# EasyEDA Pro project Control.epro

# Schematic schematic1
Create Date: 2023-08-01; Page Name: P1; Project Name: 无刷电机驱动控制板; Schematic Name: schematic1; Update Date: 2023-08-13; Company: 嘉立创EDA; Page Size: A4; Version: V1.0
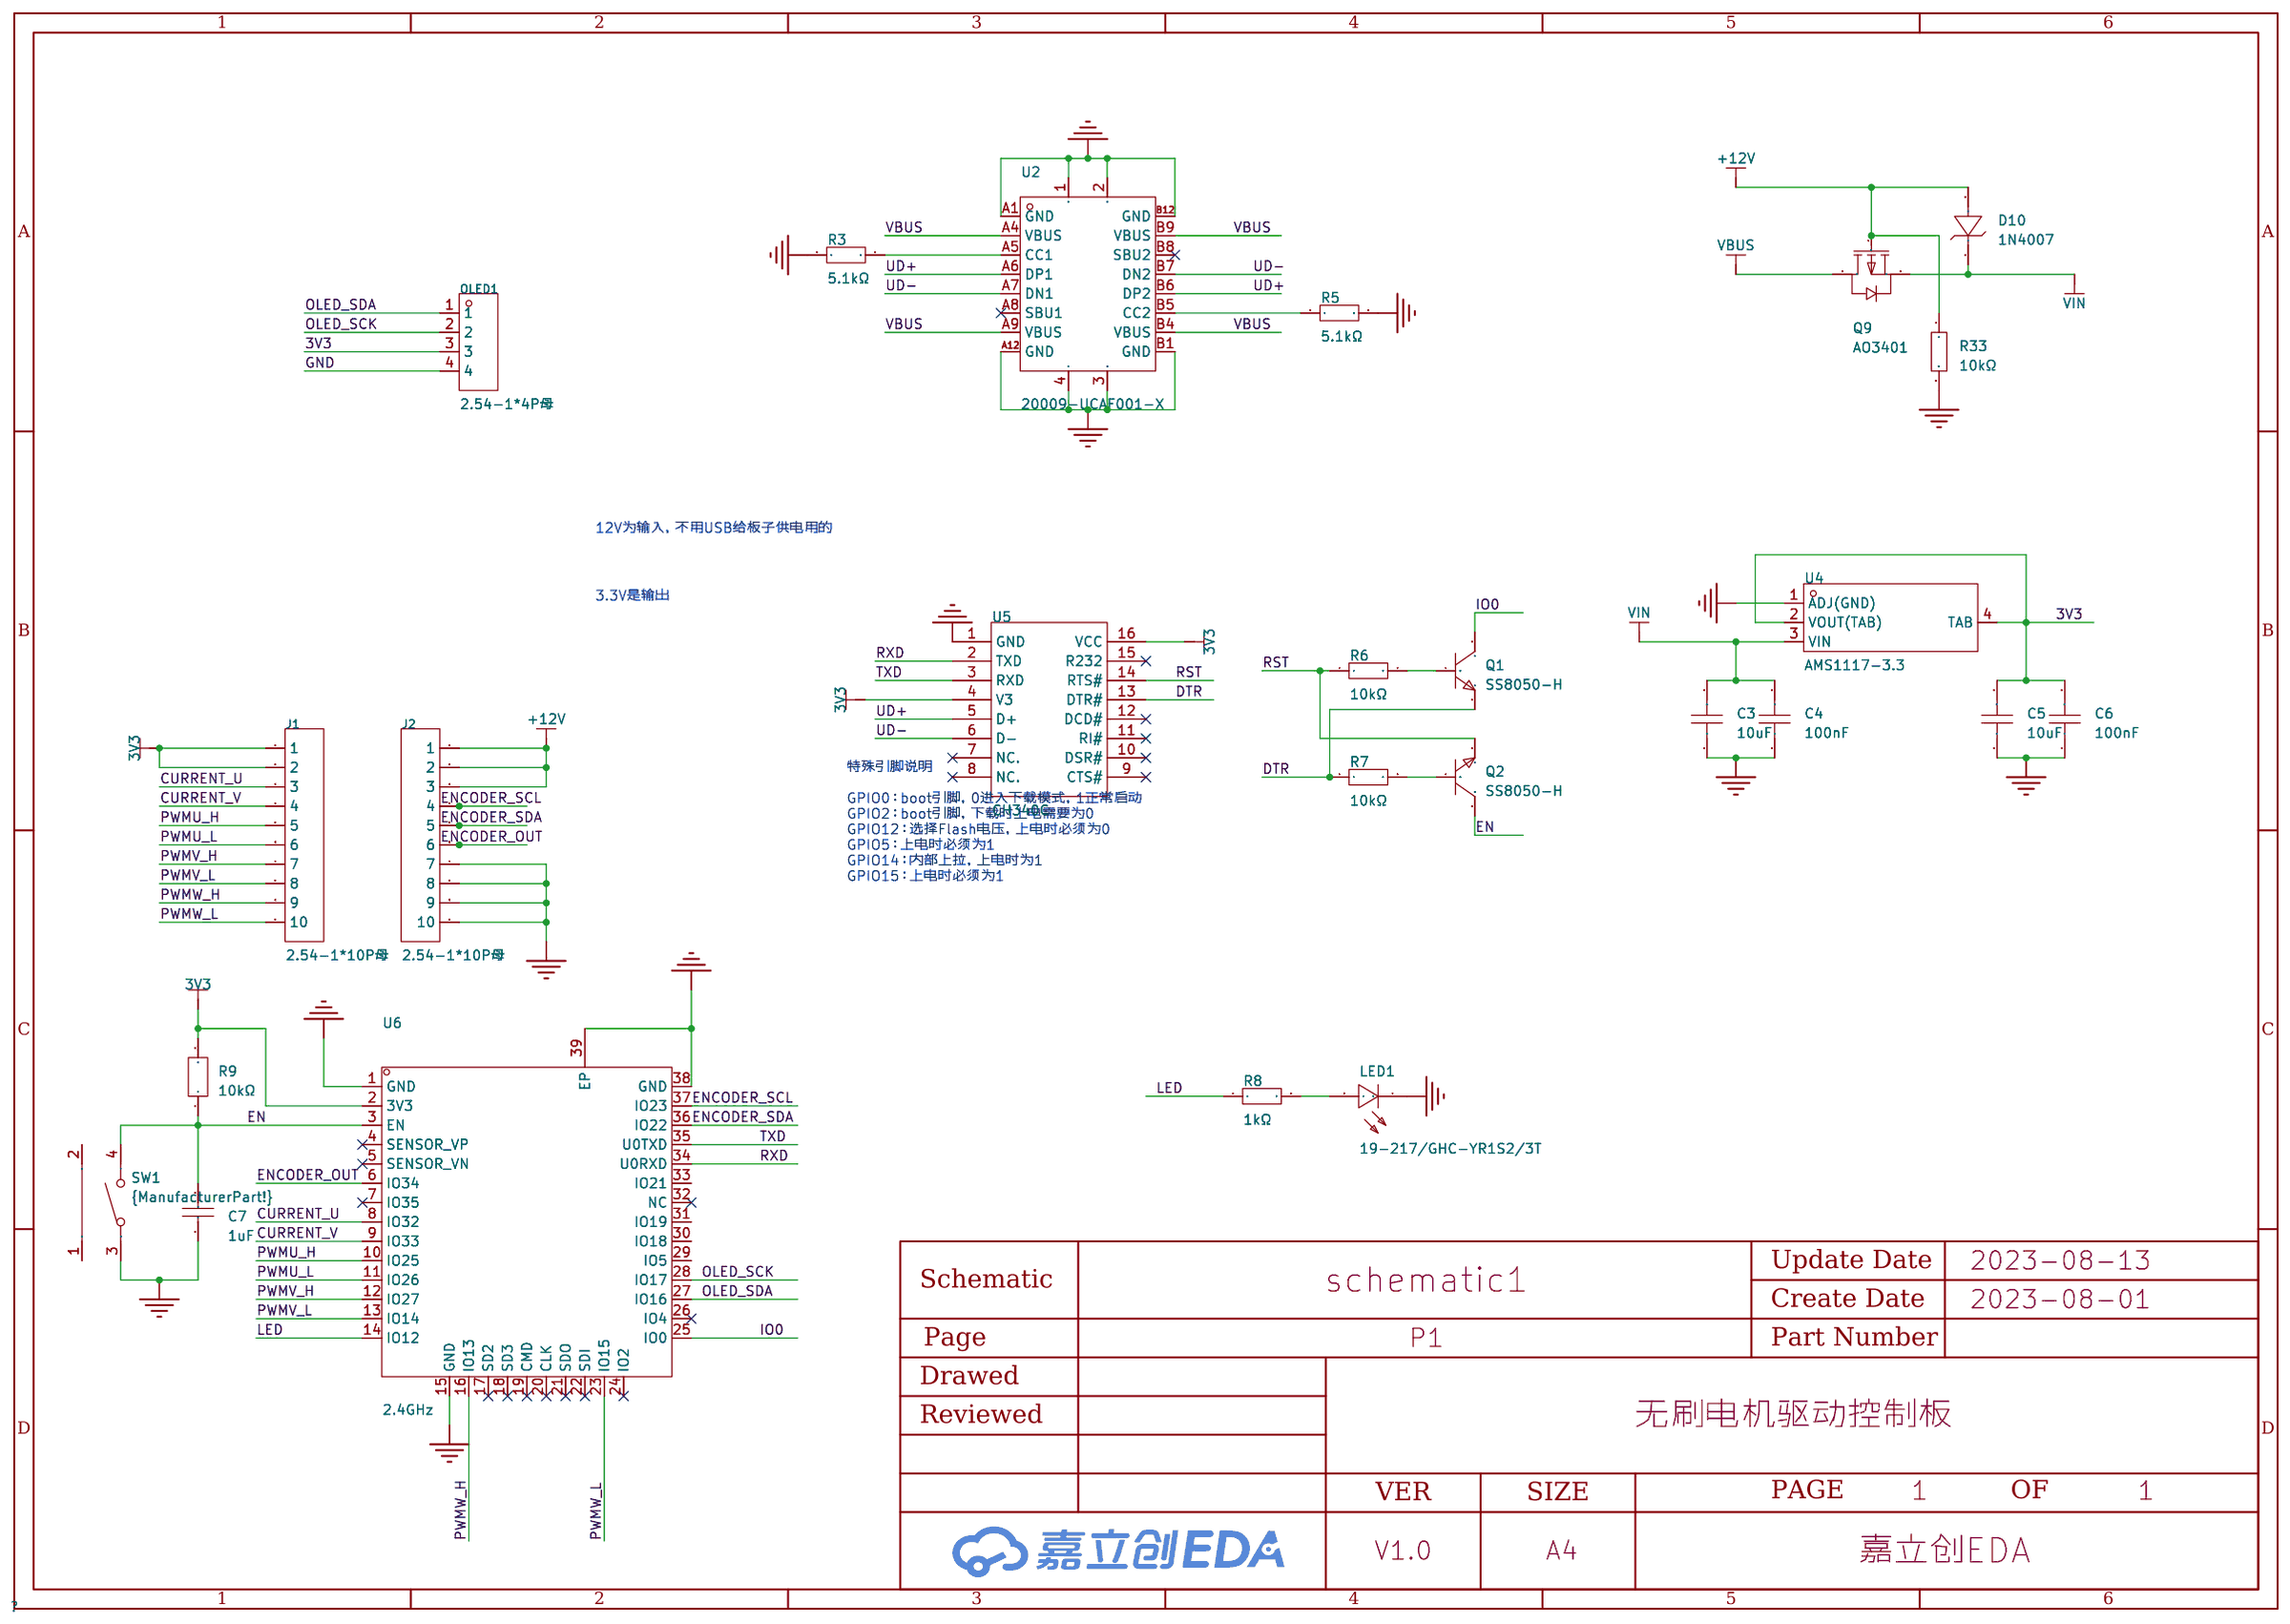
[diagram p0: schematic sheet]

## Parts
C3  10uF  [C0603]
C4  100nF  [C0603]
C5  10uF  [C0603]
C6  100nF  [C0603]
C7  1uF  [C0603]
D10  1N4007  [SOD-123FL_L2.7-W1.8-LS3.8-RD]
J1  2.54-1*10P母  [HDR-TH_10P-P2.54-V-F]
J2  2.54-1*10P母  [HDR-TH_10P-P2.54-V-F]
LED1  19-217/GHC-YR1S2/3T  [LED0603-RD]
OLED1  2.54-1*4P母  [HDR-TH_4P-P2.54-V-F]
Q1  SS8050-H  [SOT-23-3_L2.9-W1.3-P1.90-LS2.4-BR]
Q2  SS8050-H  [SOT-23-3_L2.9-W1.3-P1.90-LS2.4-BR]
Q9  AO3401  [SOT-23-3_L2.9-W1.4-P1.90-LS2.6-BR]
R3  5.1kΩ  [R0603]
R5  5.1kΩ  [R0603]
R6  10kΩ  [R0603]
R7  10kΩ  [R0603]
R8  1kΩ  [R0603]
R9  10kΩ  [R0603]
R33  10kΩ  [R0603]
SW1  -  [SW-SMD_TS24CA]
U2  20009-UCAF001-X  [TYPE-C-SMD_20009-UCAF001-X]
U4  AMS1117-3.3  [SOT-223-4_L6.5-W3.5-P2.30-LS7.0-BR]
U5  CH340C  [SOP-16_L10.0-W3.9-P1.27-LS6.0-BL]
U6  2.4GHz  [WIRELM-SMD_ESP32-S]

## Library data of the parts
C3 C5 = CL10A106MA8NRNC: 容值:10uF;精度:±20%;额定电压:25V;材质(温度系数):X5R;; LCSC Part Name: 10uF±20%25V; Supplier Part: C96446; Manufacturer: SAMSUNG(三星); Supplier Footprint: 0603; JLCPCB Part Class: BasicPart; Datasheet: https://atta.szlcsc.com/upload/public/pdf/source/20170325/1490427913016.pdf; Supplier: LCSC; Tolerance: ±20%; Voltage Rated: 25V; Temperature Coefficient: X5R
C4 C6 = CC0603KRX7R9BB104: 容值:100nF;精度:±10%;额定电压:50V;材质(温度系数):X7R;; LCSC Part Name: 100nF±10%50V; Supplier Part: C14663; Manufacturer: YAGEO(国巨); Supplier Footprint: 0603; JLCPCB Part Class: BasicPart; Datasheet: https://atta.szlcsc.com/upload/public/pdf/source/20180910/C282072_33301C7F631E79921B82A8DAC6BCC5B3.pdf; Supplier: LCSC; Tolerance: ±10%; Voltage Rated: 50V; Temperature Coefficient: X7R
C7 = CL10A105KB8NNNC: 容值:1uF;精度:±10%;额定电压:50V;材质(温度系数):X5R;; LCSC Part Name: 1uF±10%50V; Supplier Part: C15849; Manufacturer: SAMSUNG(三星); Supplier Footprint: 0603; JLCPCB Part Class: BasicPart; Datasheet: https://atta.szlcsc.com/upload/public/pdf/source/20160103/1457707679084.pdf; Supplier: LCSC; Tolerance: ±10%; Voltage Rated: 50V; Temperature Coefficient: X5R
D10 = 1N4007_C727082: 二极管配置:独立式;直流反向耐压(Vr):1kV;平均整流电流(Io):1A;正向压降(Vf):1.1V@1A;反向电流(Ir):10uA@1kV;; LCSC Part Name: 1kV 1A 1.1V@1A; Supplier Part: C727082; Manufacturer: TWGMC(台湾迪嘉); Supplier Footprint: SOD-123FL; JLCPCB Part Class: Extended Part; Datasheet: https://atta.szlcsc.com/upload/public/pdf/source/20200828/C727082_2F914037E829F0E2238583225D7ED281.pdf; Supplier: LCSC; Diode Configuration: 独立式; Reverse Voltage (Vr): 1kV; Average Rectified Current (Io): 1A; Forward Voltage (Vf@If): 1.1V@1A; Reverse Leakage Current: 10uA@1kV
J1 J2 = 2.54-1*10P母: 排数:单排;总孔位数:10;间距:2.54mm;插孔结构:1x10P;行距:-;安装类型:直插;塑高:-;触头材质:-;触头镀层:-;; LCSC Part Name: 2.54mm 1x10P; Supplier Part: C35445; Manufacturer: BOOMELE(博穆精密); Supplier Footprint: 插件,P=2.54mm; JLCPCB Part Class: Extended Part; Datasheet: https://atta.szlcsc.com/upload/public/pdf/source/20200813/C35445_A4147CED0A1C9075722E373C7771E928.pdf; Supplier: LCSC; Number of Rows: 单排; Number of Holes: 10; Pitch: 2.54mm; Holes Structure: 1x10P; Mounting Type: 直插
LED1 = 19-217/GHC-YR1S2/3T: 发光颜色:翠绿;二极管配置:-;主波长:520nm~535nm;色温:-;功率:110mW;安装方式:-;; Supplier Part: C72043; Manufacturer: EVERLIGHT(亿光); Supplier Footprint: 0603; JLCPCB Part Class: BasicPart; Datasheet: https://atta.szlcsc.com/upload/public/pdf/source/20160507/1462613613780.pdf; Supplier: LCSC; Emitted Color: 翠绿; Lens Color: 无色透明; Dominant Wavelength: 520nm~535nm; Peak Wavelength: 518nm; Forward Current: 20mA; Power Dissipation: 110mW; Viewing Angle: 120°; Operating Temperature: -40℃~+85℃
OLED1 = 2.54-1*4P母: 排数:单排;总孔位数:4P;间距:2.54mm;插孔结构:1x4P;行距:-;安装类型:直插;圆孔/方孔:方孔;额定电流:3A;额定电压:-;插孔方向:顶部;塑高:-;触头材质:青铜;触头镀层:-;工作温度范围:-40℃~+105℃;焊接温度(最大值):-;; LCSC Part Name: 2.54mm 1x4P; Supplier Part: C2718488; Manufacturer: BOOMELE(博穆精密); Supplier Footprint: 插件,P=2.54mm; JLCPCB Part Class: 扩展库; Datasheet: https://atta.szlcsc.com/upload/public/pdf/source/20210301/C2718488_F4427B881E42CAA8DDB0B1C12B3A522C.pdf; Supplier: LCSC; Number of Rows: 单排; Number of Holes: 4P; Pitch: 2.54mm; Holes Structure: 1x4P; Mounting Type: 直插; Circular Hole / Square Hole: 方孔; Current Rating (Max): 3A; Holes Direction: 顶部; Contact Material: 青铜; Operating Temperature Range: -40℃~+105℃
Q1 Q2 = SS8050-H: 晶体管类型:NPN;集射极击穿电压(Vceo):25V;集电极电流(Ic):1.5A;功率(Pd):300mW;直流电流增益(hFE@Ic,Vce):200@100mA,1V;; LCSC Part Name: NPN25V1.5A; Supplier Part: C699255; Manufacturer: YANGJIE(扬杰); Supplier Footprint: SOT-23-3L; JLCPCB Part Class: ExtendedPart; Datasheet: https://atta.szlcsc.com/upload/public/pdf/source/20200709/C699255_98BD284548BE18129453A2CE3A1F2C22.pdf; Supplier: LCSC; Transistor Type: NPN; Collector-Emitter Breakdown Voltage (Vceo): 25V; Collector Current (Ic): 1.5A; Power Dissipation (Pd): 300mW; Collector Cut-Off Current (Icbo): 100nA; Collector-Emitter Saturation Voltage (VCE(sat)@Ic,Ib): 500mV@800mA,80mA; DC Current Gain (hFE@Ic,Vce): 200@100mA,1V; Transition Frequency (fT): 100MHz; Operating Temperature: -55℃~+150℃@(Tj)
Q9 = AO3401_C727156: 类型:P沟道;漏源电压(Vdss):30V;连续漏极电流(Id):4.2A;功率(Pd):350mW;导通电阻(RDS(on)@Vgs,Id):65mΩ@10V,4.2A;; LCSC Part Name: P沟道 30V 4.2A; Supplier Part: C727156; Manufacturer: TWGMC(台湾迪嘉); Supplier Footprint: SOT-23; JLCPCB Part Class: Extended Part; Datasheet: https://atta.szlcsc.com/upload/public/pdf/source/20200827/C727156_6E081BBEEFBC6B8FEE164CB196B0AF30.pdf; Supplier: LCSC; Type: P沟道; Drain Source Voltage (Vdss): 30V; Continuous Drain Current (Id): 4.2A; Power Dissipation (Pd): 350mW; Drain Source On Resistance (RDS(on)@Vgs,Id): 65mΩ@10V,4.2A; Gate Threshold Voltage (Vgs(th)@Id): 1.3V@250uA
R3 R5 = 0603WAF5101T5E: 电阻类型:厚膜电阻;阻值:5.1kΩ;精度:±1%;功率:100mW;; LCSC Part Name: 5.1kΩ±1%100mW; Supplier Part: C23186; Manufacturer: UNI-ROYAL(厚声); Supplier Footprint: 0603; JLCPCB Part Class: BasicPart; Datasheet: https://atta.szlcsc.com/upload/public/pdf/source/20200306/C422600_1E6D84923E4A46A82E41ADD87F860B5C.pdf; Supplier: LCSC; Type: 厚膜电阻; Tolerance: ±1%; Power(Watts): 100mW; Temperature Coefficient: ±100ppm/℃; Overload Voltage (Max): 75V; Operating Temperature Range: -55℃~+155℃
R6 R7 = ERJ3EKF1002V: 电阻类型:厚膜电阻;阻值:10kΩ;精度:±1%;功率:100mW;; LCSC Part Name: 厚膜电阻10kΩ±1%100mW; Supplier Part: C191124; Manufacturer: PANASONIC(松下); Supplier Footprint: 0603; JLCPCB Part Class: ExtendedPart; Datasheet: https://atta.szlcsc.com/upload/public/pdf/source/20180502/C191124_A4CEFA964CCDF04BFD540D495CFFCAE0.pdf; Supplier: LCSC; Type: 厚膜电阻; Tolerance: ±1%; Power(Watts): 100mW; Temperature Coefficient: ±100ppm/℃; Operating Temperature Range: -55℃~+155℃
R8 = 0603WAF1001T5E: 电阻类型:厚膜电阻;阻值:1kΩ;精度:±1%;功率:100mW;; LCSC Part Name: 1kΩ±1%100mW; Supplier Part: C21190; Manufacturer: UNI-ROYAL(厚声); Supplier Footprint: 0603; JLCPCB Part Class: BasicPart; Datasheet: https://atta.szlcsc.com/upload/public/pdf/source/20200306/C422600_1E6D84923E4A46A82E41ADD87F860B5C.pdf; Supplier: LCSC; Type: 厚膜电阻; Tolerance: ±1%; Power(Watts): 100mW; Temperature Coefficient: ±100ppm/℃; Overload Voltage (Max): 75V; Operating Temperature Range: -55℃~+155℃
R9 = SG73P1JTTD1002F: 阻值:10kΩ;精度:±1%;功率:-;; LCSC Part Name: 10kΩ±1%; Supplier Part: C880254; Manufacturer: KOA; Supplier Footprint: 0603; JLCPCB Part Class: ExtendedPart; Datasheet: https://atta.szlcsc.com/upload/public/pdf/source/20190109/C346159_A2BB9C83E7E727C8F8277542505B206B.pdf; Supplier: LCSC; Tolerance: ±1%
R33 = 0603WAF1002T5E: 电阻类型:厚膜电阻;阻值:10kΩ;精度:±1%;功率:100mW;; LCSC Part Name: 厚膜电阻10kΩ±1%100mW; Supplier Part: C25804; Manufacturer: UNI-ROYAL(厚声); Supplier Footprint: 0603; JLCPCB Part Class: BasicPart; Datasheet: https://atta.szlcsc.com/upload/public/pdf/source/20200306/C422600_1E6D84923E4A46A82E41ADD87F860B5C.pdf; Supplier: LCSC; Type: 厚膜电阻; Tolerance: ±1%; Power(Watts): 100mW; Temperature Coefficient: ±100ppm/℃; Overload Voltage (Max): 75V; Operating Temperature Range: -55℃~+155℃
SW1 = TS24CA: 触点电流:50mA;额定电压(DC):12V;电路结构:单刀单掷;安装方式:卧贴;带灯:-;机械寿命:-;; LCSC Part Name: 4.55*1.8*3.5mm卧贴轻触开关; Supplier Part: C393942; Manufacturer: SHOUHAN(首韩); Supplier Footprint: SMD; JLCPCB Part Class: ExtendedPart; Datasheet: https://atta.szlcsc.com/upload/public/pdf/source/20190521/C393942_591A9E318887EFA4274D34029981AD99.pdf; Supplier: LCSC; Contact Current: 50mA; Voltage Rating (DC): 12V; Circuit: 单刀单掷; Mounting Style: 卧贴; Actuator Style: 矩形按钮; Switch Length: 4.55mm; Switch Width: 1.8mm; Switch Height: 3.5mm
U2 = 20009-UCAF001-X: LCSC Part Name: TYPEC; Supplier Part: C3148200; Manufacturer: MINTRON(明硕); Supplier Footprint: SMD; JLCPCB Part Class: ExtendedPart; Datasheet: https://atta.szlcsc.com/upload/public/pdf/source/20220705/4C04992B6F70FB490BC74B4779796E6C.pdf; Supplier: LCSC
U4 = AMS1117-3.3_C347222: 输出类型:固定;输出极性:正;最大输入电压:18V;输出电压:3.3V;输出电流:1A;电源纹波抑制比(PSRR):60dB@(120Hz);; Supplier Part: C347222; Manufacturer: UMW(广东友台半导体); Supplier Footprint: SOT-223; JLCPCB Part Class: ExtendedPart; Datasheet: https://atta.szlcsc.com/upload/public/pdf/source/20211011/50CC665C22E3A66C08379A4A74BDA25C.pdf; Supplier: LCSC; Output Type: 固定; Output Polarity: 正; Number of Outputs: 1; Maximum Input Voltage: 18V; Output Voltage: 3.3V; Dropout Voltage: 1.3V@(1A); Output Current: 1A; Power Supply Rejection Ratio (PSRR): 60dB@(120Hz)
U5 = CH340C: 应用功能:Transceiver;接口协议:USB2.0;数据速率:2Mbps;供电电压:3.3V；5V;; Supplier Part: C84681; Manufacturer: WCH(南京沁恒); Supplier Footprint: SOP-16; JLCPCB Part Class: ExtendedPart; Datasheet: https://atta.szlcsc.com/upload/public/pdf/source/20200819/C84681_ADBED554CE321879DBD6B1D06488689C.pdf; Supplier: LCSC; Applications Function: Transceiver; Protocol: USB2.0; Data Rate: 2Mbps; Supply Voltage: 3.3V；5V
U6 = ESP32-S: 频率:2.4GHz;发射功率:17dBm;核心处理器:LX6;天线形式:板载PCB天线/外接IPEX;接收灵敏度:-90dBm;; Supplier Part: C277944; Manufacturer: Ai-Thinker(安信可); Supplier Footprint: SMD; JLCPCB Part Class: ExtendedPart; Datasheet: https://atta.szlcsc.com/upload/public/pdf/source/20211217/F4BEA33E732D6002D10DAED85BBCB52B.pdf; Supplier: LCSC; Output Power: 17dBm; Core Processor: LX6; Support Interface: I2C；UART；DAC；SPI；PWM；ADC; Antenna Type: 板载PCB天线/外接IPEX; Wireless Standard: 802.11b/g/n; Operating Voltage: 3.3V; Sensitivity: -90dBm; Operating Temperature: -40℃~+85℃

## Nets
3V3: C5.2 C6.2 J1.1 J1.2 OLED1.3 R9.2 U4.2(VOUT(TAB)) U4.4(TAB) U5.4(V3) U5.16(VCC) U6.2(3V3)
+12V: D10.2(A) J2.1 J2.2 J2.3 Q9.1(G) R33.1
GND: C3.1 C4.1 C5.1 C6.1 C7.1 J2.7 J2.8 J2.9 J2.10 LED1.1(C) OLED1.4 R3.1 R5.2 R33.2 SW1.3 U2.1 U2.2 U2.3 U2.4 U2.A1(GND) U2.A12(GND) U2.B1(GND) U2.B12(GND) U4.1(ADJ(GND)) U5.1(GND) U6.1(GND) U6.15(GND) U6.38(GND) U6.39(EP)
VBUS: Q9.3(D) U2.A4(VBUS) U2.A9(VBUS) U2.B4(VBUS) U2.B9(VBUS)
VIN: C3.2 C4.2 D10.1(K) Q9.2(S) U4.3(VIN)
CURRENT_U: J1.3 U6.8(IO32)
CURRENT_V: J1.4 U6.9(IO33)
DTR: Q1.2(E) R7.1 U5.13(DTR#)
EN: C7.2 Q2.3(C) R9.1 SW1.4 U6.3(EN)
ENCODER_OUT: J2.6 U6.6(IO34)
ENCODER_SCL: J2.4 U6.37(IO23)
ENCODER_SDA: J2.5 U6.36(IO22)
IO0: Q1.3(C) U6.25(IO0)
LED: R8.1 U6.14(IO12)
OLED_SCK: OLED1.2 U6.28(IO17)
OLED_SDA: OLED1.1 U6.27(IO16)
PWMU_H: J1.5 U6.10(IO25)
PWMU_L: J1.6 U6.11(IO26)
PWMV_H: J1.7 U6.12(IO27)
PWMV_L: J1.8 U6.13(IO14)
PWMW_H: J1.9 U6.16(IO13)
PWMW_L: J1.10 U6.23(IO15)
RST: Q2.2(E) R6.1 U5.14(RTS#)
RXD: U5.2(TXD) U6.34(U0RXD)
TXD: U5.3(RXD) U6.35(U0TXD)
UD+: U2.A6(DP1) U2.B6(DP2) U5.5(D+)
UD-: U2.A7(DN1) U2.B7(DN2) U5.6(D-)
$1N6557: R3.2 U2.A5(CC1)
$1N6560: R5.1 U2.B5(CC2)
$1N6577: Q1.1(B) R6.2
$1N6578: Q2.1(B) R7.2
$1N6601: LED1.2(A) R8.2

Not connected (* = marked no-connect by the designer): SW1 1 2; U2 A8(SBU1)* B8(SBU2)*; U5 7(NC.)* 8(NC.)* 9(CTS#)* 10(DSR#)* 11(RI#)* 12(DCD#)* 15(R232)*; U6 4(SENSOR_VP)* 5(SENSOR_VN)* 7(IO35)* 17(SD2)* 18(SD3)* 19(CMD)* 20(CLK)* 21(SDO)* 22(SDI)* 24(IO2)* 26(IO4)* 29(IO5) 30(IO18) 31(IO19) 32(NC)* 33(IO21)

## Notes on the sheet
- 12V为输入，不用USB给板子供电用的
- 3.3V是输出
- 特殊引脚说明
  GPIO0：boot引脚，0进入下载模式，1正常启动
  GPIO2：boot引脚，下载时上电需要为0
  GPIO12：选择Flash电压，上电时必须为0
  GPIO5：上电时必须为1
  GPIO14：内部上拉，上电时为1
  GPIO15：上电时必须为1

# Board PCB1
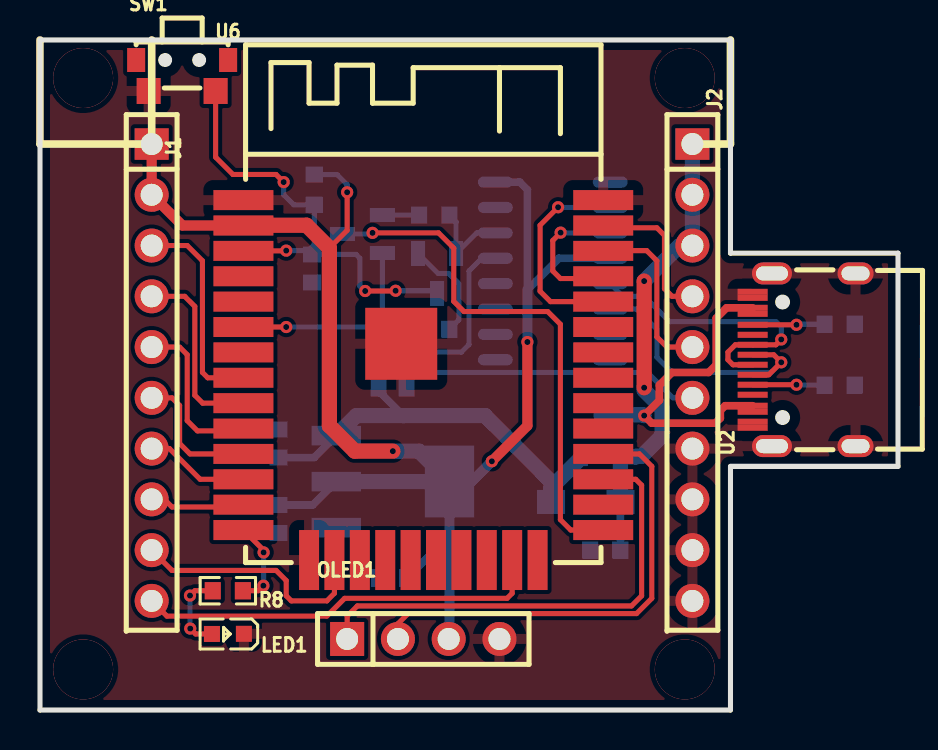
[diagram p1: board, top side]
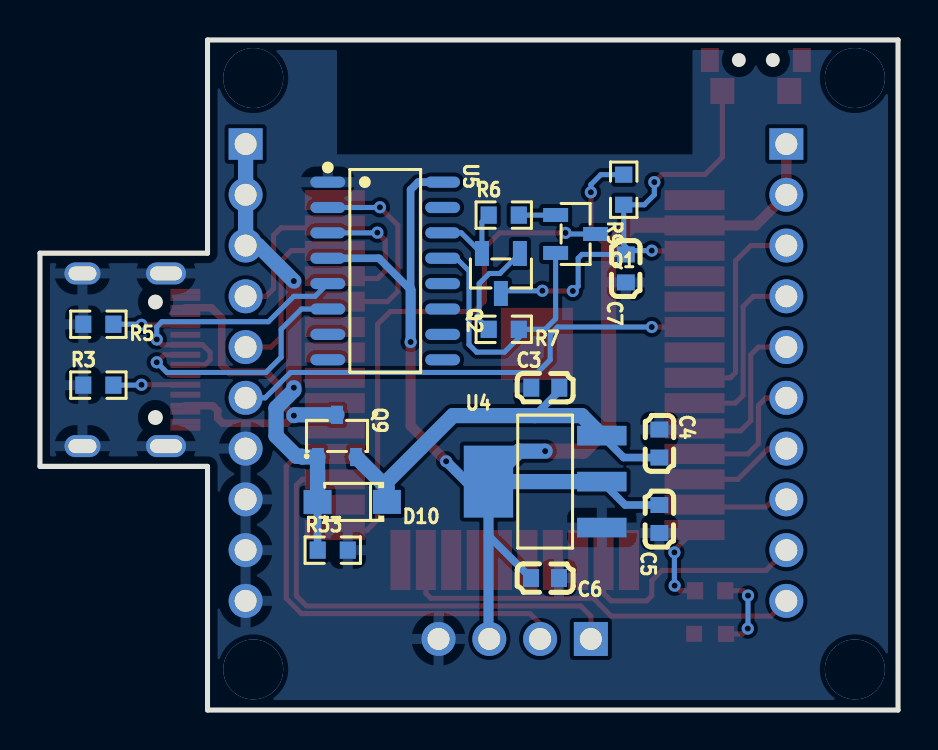
[diagram p2: board, bottom side, seen from below]

Outline 42.93 x 33.53 mm; copper layers: Top Layer, Bottom Layer. Coordinates in mm from the lower left corner of the outline.
Outline path: 0,33.53 34.54,33.53 34.54,22.86 42.93,22.86 42.93,12.19 34.54,12.19 34.54,0 0,0 0,33.53
Stack: Top Layer 0.035mm / Dielectric1 1.51mm FR4 er 4.5 / Bottom Layer 0.035mm

## Design rules (mm)
template: 自定义配置
spacing copperThickness1oz (default): track to track 0.102, other pairs 0.152 to 0.3
spacing copperThickness2oz: track to track 0.203, other pairs 0.152 to 0.3
spacing safeClearance: track to track 0.152, other pairs 0.145 to 0.3
track width copperThickness1oz (default): min 0.127, default 0.254, max 2.54
track width copperThickness2oz: min 0.203, default 0.254, max 2.54
track width trackWidth: min 0.127, default 0.254, max 2.54
differential pair differentialPair (default): width min 0.127, default 0.254, max 2.54; gap min 0.152, default 0.152
via viaSize (default): diameter min 0.5, default 0.61, max 10; hole min 0.3, default 0.305, max 6

## Placement (name value [footprint] x y rotation side)
C3  10uF  [C0603]  17.65 16.13 180 bottom
C4  100nF  [C0603]  11.94 13.33 270 bottom
C5  10uF  [C0603]  11.94 9.56 90 bottom
C6  100nF  [C0603]  17.66 6.6 0 bottom
C7  1uF  [C0603]  13.62 22.1 90 bottom
D10  1N4007  [SOD-123FL_L2.7-W1.8-LS3.8-RD]  27.31 10.41 0 bottom
J1  2.54-1*10P母  [HDR-TH_10P-P2.54-V-F]  5.59 16.89 270 top
J2  2.54-1*10P母  [HDR-TH_10P-P2.54-V-F]  32.64 16.89 270 top
LED1  19-217/GHC-YR1S2/3T  [LED0603-RD]  9.4 3.81 180 top
OLED1  2.54-1*4P母  [HDR-TH_4P-P2.54-V-F]  19.18 3.56 0 top
Q1  SS8050-H  [SOT-23-3_L2.9-W1.3-P1.90-LS2.4-BR]  16.13 23.82 0 bottom
Q2  SS8050-H  [SOT-23-3_L2.9-W1.3-P1.90-LS2.4-BR]  19.87 21.84 90 bottom
Q9  AO3401  [SOT-23-3_L2.9-W1.4-P1.90-LS2.6-BR]  28.07 13.72 270 bottom
R3  5.1kΩ  [R0603]  40 16.26 180 bottom
R5  5.1kΩ  [R0603]  40 19.3 0 bottom
R6  10kΩ  [R0603]  19.73 24.77 180 bottom
R7  10kΩ  [R0603]  19.73 19.05 0 bottom
R8  1kΩ  [R0603]  9.4 5.97 180 top
R9  10kΩ  [R0603]  13.72 26.03 90 bottom
R33  10kΩ  [R0603]  28.28 8 180 bottom
SW1  -  [SW-SMD_TS24CA]  7.11 31.75 0 top
U2  20009-UCAF001-X  [TYPE-C-SMD_20009-UCAF001-X]  38.23 17.53 90 top
U4  AMS1117-3.3  [SOT-223-4_L6.5-W3.5-P2.30-LS7.0-BR]  17.65 11.43 180 bottom
U5  CH340C  [SOP-16_L10.0-W3.9-P1.27-LS6.0-BL]  25.65 21.97 270 bottom
U6  2.4GHz  [WIRELM-SMD_ESP32-S]  19.18 16.51 0 top

## Footprints (pads in the part's own frame, mm; a bottom-side part is the same pattern mirrored in y, then rotated)
C0603
  rect 0.8x0.9 smd: 1(-0.7,0) 2(0.7,0)
HDR-TH_4P-P2.54-V-F
  rect 1.7x1.7 hole 1.1: 1(-3.81,0)
  round 1.7 hole 1.1: 2(-1.27,0) 3(1.27,0) 4(3.81,0)
HDR-TH_10P-P2.54-V-F
  rect 1.575x1.7 hole 1.1: 1(-11.43,0)
  round 1.7 hole 1.1: 2(-8.89,0) 3(-6.35,0) 4(-3.81,0) 5(-1.27,0) 6(1.27,0) 7(3.81,0) 8(6.35,0) 9(8.89,0) 10(11.43,0)
LED0603-RD
  rect 0.8x0.8 smd: 1(-0.799,-0.004) 2(0.799,0.004)
R0603
  rect 0.806x0.864 smd: 1(-0.753,0) 2(0.753,0)
SOD-123FL_L2.7-W1.8-LS3.8-RD
  rect 1.4x1.2 smd: 1(-1.735,0) 2(1.735,0)
SOP-16_L10.0-W3.9-P1.27-LS6.0-BL
  oval 0.56x1.745 smd: 1(-4.445,-2.873) 2(-3.175,-2.873) 3(-1.905,-2.873) 4(-0.635,-2.873) 5(0.635,-2.873) 6(1.905,-2.873) 7(3.175,-2.873) 8(4.445,-2.873) 9(4.445,2.873) 10(3.175,2.873) 11(1.905,2.873) 12(0.635,2.873) 13(-0.635,2.873) 14(-1.905,2.873) 15(-3.175,2.873) 16(-4.445,2.873)
SOT-23-3_L2.9-W1.3-P1.90-LS2.4-BR
  rect 1.25x0.7 smd: 1(1,-0.95) 2(1,0.95) 3(-1,0)
SOT-23-3_L2.9-W1.4-P1.90-LS2.6-BR
  rect 0.91x0.6 smd: 1(1.055,-0.955) 2(1.055,0.955) 3(-1.055,0)
SOT-223-4_L6.5-W3.5-P2.30-LS7.0-BR
  rect 2.47x0.98 smd: 1(2.835,-2.3) 2(2.835,0) 3(2.835,2.3)
  rect 2.47x3.6 smd: 4(-2.835,0)
SW-SMD_TS24CA
  rect 0.9x1.2 smd: 1(-2.3,0.775) 2(2.3,0.775)
  rect 1.2x1.3 smd: 3(-1.675,-0.775) 4(1.675,-0.775)
TYPE-C-SMD_20009-UCAF001-X
  oval 1.1x2 hole 0.7x1.6: 1(-4.32,1.606) 2(4.32,1.606)
  oval 1.1x1.8 hole 0.7x1.4: 3(4.32,-2.574) 4(-4.32,-2.574)
  rect 0.3x1.5 smd: A1(-3.4,2.573) A4(-2.6,2.573) A5(-1.25,2.573) A6(-0.25,2.573) A7(0.25,2.573) A8(1.25,2.574) A9(2.6,2.574) A12(3.4,2.573) B1(3.1,2.573) B4(2.3,2.574) B5(1.75,2.573) B6(0.75,2.573) B7(-0.75,2.573) B8(-1.75,2.574) B9(-2.3,2.573) B12(-3.1,2.573)
WIRELM-SMD_ESP32-S
  rect 3x1 smd: 1(-9,9.005) 2(-9,7.735) 3(-9,6.465) 4(-9,5.195) 5(-9,3.925) 6(-9,2.655) 7(-9,1.385) 8(-9,0.115) 9(-9,-1.155) 10(-9,-2.425) 11(-9,-3.695) 12(-9,-4.965) 13(-9,-6.235) 14(-9,-7.505) 25(9,-7.505) 26(9,-6.235) 27(9,-4.965) 28(9,-3.695) 29(9,-2.425) 30(9,-1.155) 31(9,0.115) 32(9,1.385) 33(9,2.655) 34(9,3.925) 35(9,5.195) 36(9,6.465) 37(9,7.735) 38(9,9.005)
  rect 1x3 smd: 15(-5.715,-9.005) 16(-4.445,-9.005) 17(-3.175,-9.005) 18(-1.905,-9.005) 19(-0.635,-9.005) 20(0.635,-9.005) 21(1.905,-9.005) 22(3.175,-9.005) 23(4.445,-9.005) 24(5.715,-9.005)
  rect 3.6x3.6 smd: 39(-1.105,1.815)

## Nets
As in the schematic.

Pads without a net: SW1 1 2; U2 A8 B8; U5 7 8 9 10 11 12 15; U6 4 5 7 17 18 19 20 21 22 24 26 29 30 31 32 33

## Via types
v1: diameter 3, hole 3, Top Layer to Bottom Layer, 4 vias
v2: diameter 0.61, hole 0.305, Top Layer to Bottom Layer, 23 vias

## Routing (per net, layer and track width the routed paths; a pad name or vN(x,y) marks a point on that pad's centre or on a via; arc(x,y) is an arc through that point)
3V3: length 77.4
  Top Layer w0.254: v2(15.37,25.91) 15.37,24 14.48,23.11
  Top Layer w0.508: J1.1 J1.2 7.12,24.24 U6.2 ; v2(22.61,12.45) 24.38,14.22 v2(24.38,18.41)
  Top Layer w0.762: U6.2 10.19,24.26 13.34,24.26 14.48,23.11 14.48,14.22 15.75,12.95 v2(17.65,12.95)
  Bottom Layer w0.254: v2(15.37,25.91) 15.37,26.29 14.87,26.79 R9.2
  Bottom Layer w0.381: U5.4 25.97,22.61 24.38,21.02 24.38,26.03 24,26.42 U5.16 ; C5.2 13.65,10.26 U4.2 ; C6.2 20.49,8.73
  Bottom Layer w0.508: v2(24.38,18.41) 24.38,21.02 ; v2(22.61,12.45) 21.59,11.43 U4.4 20.49,3.6 OLED1.3
  Bottom Layer w0.762: U4.2 U4.4 18.96,12.95 v2(17.65,12.95)
+12V: length 23.5
  Top Layer w0.762: v2(30.23,16.13) v2(30.23,21.46)
  Bottom Layer w0.381: D10.2 29.04,8.01 R33.1
  Bottom Layer w0.762: v2(30.23,21.46) 32,23.24 J2.3 J2.2 J2.1 ; v2(30.23,16.13) 30.23,16 31.12,15.11 31.12,13.72 30.1,12.7 29.84,12.7 29.81,12.66 Q9.1 29.04,12.64 D10.2
VBUS: length 17.8
  Top Layer w0.381: U2.A9 34.35,20.13 33.83,19.61 33.83,17.27 33.45,16.89 31.62,16.89 30.99,16.26 30.99,15.49 v2(30.23,14.73) 30.61,14.35 33.78,14.35 34.04,14.6 34.04,14.99 34.28,15.23 U2.B9
  Bottom Layer w0.762: Q9.3 30.19,14.77 v2(30.23,14.73)
VIN: length 21
  Bottom Layer w0.381: C3.2 16.94,15.96 18.18,14.73 ; U4.3 13.72,12.63 C4.2
  Bottom Layer w0.762: 25.57,11.12 D10.1 ; 25.57,11.12 25.57,11.43 22.27,14.73 15.82,14.73 U4.3 ; 25.57,11.12 Q9.2
(no net):
  vias: v1(2.16,31.62) v1(2.16,2.03) v1(32.26,31.62) v1(32.26,2.03)
CURRENT_U: length 10.6
  Top Layer w0.254: U6.8 8.39,16.62 8.13,16.89 8.13,22.48 7.37,23.24 J1.3
CURRENT_V: length 9.4
  Top Layer w0.254: J1.4 7.24,20.7 7.75,20.19 7.75,15.75 8.14,15.35 U6.9
DTR: length 14
  Bottom Layer w0.254: Q1.2 17.13,19.57 17.65,19.05 R7.1 18.97,18.62 19.69,17.91 21.08,17.91 21.46,18.29 21.46,21.97 22.1,22.61 U5.13
EN: length 23.4
  Top Layer w0.254: v2(12.32,22.99) 12.31,22.97 U6.3 ; v2(16.27,20.97) 17.78,20.97 ; v2(12.19,26.42) 11.81,26.8 9.65,26.8 8.79,27.66 SW1.4
  Bottom Layer w0.254: v2(12.19,26.42) 12.19,25.78 12.69,25.28 R9.1 13.72,23.28 13.43,22.99 ; Q2.3 19.73,20.98 v2(17.79,20.98) ; 13.43,22.99 C7.2 15.81,22.8 16,22.61 16,21.21 16.26,20.95 ; 13.43,22.99 v2(12.32,22.99)
ENCODER_OUT: length 24.7
  Top Layer w0.254: U6.6 v2(12.32,19.16)
  Bottom Layer w0.254: v2(12.32,19.16) 17.03,19.16 17.4,18.8 17.4,17.53 18.03,16.89 30.39,16.89 31.66,15.62 J2.6
ENCODER_SCL: length 7.5
  Top Layer w0.254: U6.37 28.29,24.13 30.86,24.13 31.24,23.75 31.24,21.08 31.62,20.7 J2.4
ENCODER_SDA: length 8.7
  Top Layer w0.254: U6.36 28.19,22.99 30.35,22.99 30.86,22.48 30.86,18.67 31.37,18.16 J2.5
IO0: length 26.5
  Top Layer w0.254: U6.25 26.56,9 26.03,9.52 26.03,19.3 25.4,19.94 21.21,19.94 20.7,20.45 20.7,23.11 19.94,23.88 v2(16.64,23.88)
  Bottom Layer w0.254: v2(16.64,23.88) 16.58,23.82 Q1.3
LED: length 4.5
  Top Layer w0.254: v2(11.18,6.22) 10.92,5.97 R8.1 ; U6.14 11.18,8.01 11.18,7.87
  Bottom Layer w0.254: v2(11.19,7.89) 11.19,6.1
OLED_SCK: length 23.3
  Top Layer w0.254: U6.28 29.98,12.81 30.61,12.19 30.61,5.59 29.84,4.83 18.42,4.83 17.91,4.32 OLED1.2
OLED_SDA: length 23.9
  Top Layer w0.254: OLED1.1 15.37,4.7 15.88,5.21 29.59,5.21 30.1,5.71 30.1,11.25 29.8,11.55 U6.27
PWMU_H: length 8.3
  Top Layer w0.254: U6.10 10.06,13.97 7.87,13.97 7.37,14.48 7.37,17.78 6.99,18.16 J1.5
PWMU_L: length 6.9
  Top Layer w0.254: U6.11 7.5,12.81 6.99,13.33 6.99,15.24 6.6,15.62 J1.6
PWMV_H: length 5.2
  Top Layer w0.254: J1.7 6.48,13.08 8.01,11.55 U6.12
PWMV_L: length 4.8
  Top Layer w0.254: U6.13 10.06,10.16 6.6,10.16 6.22,10.54 J1.8
PWMW_H: length 12.5
  Top Layer w0.254: U6.16 14.73,5.84 14.35,5.46 12.57,5.46 12.32,5.71 12.32,6.48 11.81,6.98 6.6,6.98 J1.9
PWMW_L: length 20.5
  Top Layer w0.254: J1.10 6.35,4.7 14.35,4.7 15.24,5.59 23.37,5.59 23.62,5.84 U6.23
RST: length 4.5
  Bottom Layer w0.254: R6.1 20.82,24.43 Q2.2 21.85,23.88 U5.14
RXD: length 10.6
  Top Layer w0.254: 28.18,20.44 25.54,20.44 25.02,20.95 25.02,24.26 v2(25.92,25.16)
  Bottom Layer w0.254: U5.2 25.91,25.15
TXD: length 7.3
  Top Layer w0.254: v2(26.05,23.89) 25.65,23.49 25.65,21.97 26.03,21.59 28.06,21.59 U6.35
  Bottom Layer w0.254: U5.3 26.03,23.88
UD+: length 14.7
  Top Layer w0.254: U2.A6 34.67,17.28 34.42,17.53 34.42,17.91 34.79,18.28 U2.B6 36.82,18.28 v2(37.08,18.54)
  Bottom Layer w0.254: v2(37.08,18.54) 37.08,19.18 36.83,19.43 31.5,19.43 30.23,20.7 29.16,20.7 U5.5
UD-: length 14.2
  Top Layer w0.254: U2.A7 36.71,17.78 v2(37.08,17.4) 36.46,16.78 U2.B7
  Bottom Layer w0.254: U5.6 29.84,20.07 30.86,19.05 30.86,17.65 31.62,16.89 36.58,16.89 v2(37.08,17.4)
$1N6557: length 3.6
  Top Layer w0.254: v2(37.85,16.28) U2.A5
  Bottom Layer w0.254: v2(37.85,16.28) 37.87,16.26 R3.2
$1N6560: length 3.6
  Top Layer w0.254: U2.B5 v2(37.85,19.28)
  Bottom Layer w0.254: v2(37.85,19.28) 37.87,19.3 R5.1
$1N6577: length 1.8
  Bottom Layer w0.254: Q1.1 17.13,24.77 R6.2
$1N6578: length 5.1
  Bottom Layer w0.254: Q2.1 19.92,21.84 20.45,21.84 20.96,21.34 20.96,19.53 R7.2
$1N6601: length 4.1
  Top Layer w0.254: R8.2 7.75,5.97 7.49,5.71 ; LED1.2 7.79,3.81 v2(7.52,4.08)
  Bottom Layer w0.254: v2(7.5,5.73) 7.5,4.06

## Copper pours and planes (outline as drawn; the poured copper is in the pictures)
GND on Top Layer: 0,33.53 10.3,33.53 10.3,27.81 28.07,27.81 28.07,33.53 34.54,33.53 34.54,22.86 42.93,22.86 42.93,12.19 34.67,12.19 34.54,12.06 34.54,0 0,0
GND on Bottom Layer: 0,33.53 10.27,33.53 10.29,33.51 10.29,27.81 28.07,27.81 28.07,33.53 34.54,33.53 34.54,22.86 42.93,22.86 42.93,12.19 34.54,12.19 34.54,0 0,0
